# Altium schematic sheet Photo3.SchDoc
size A
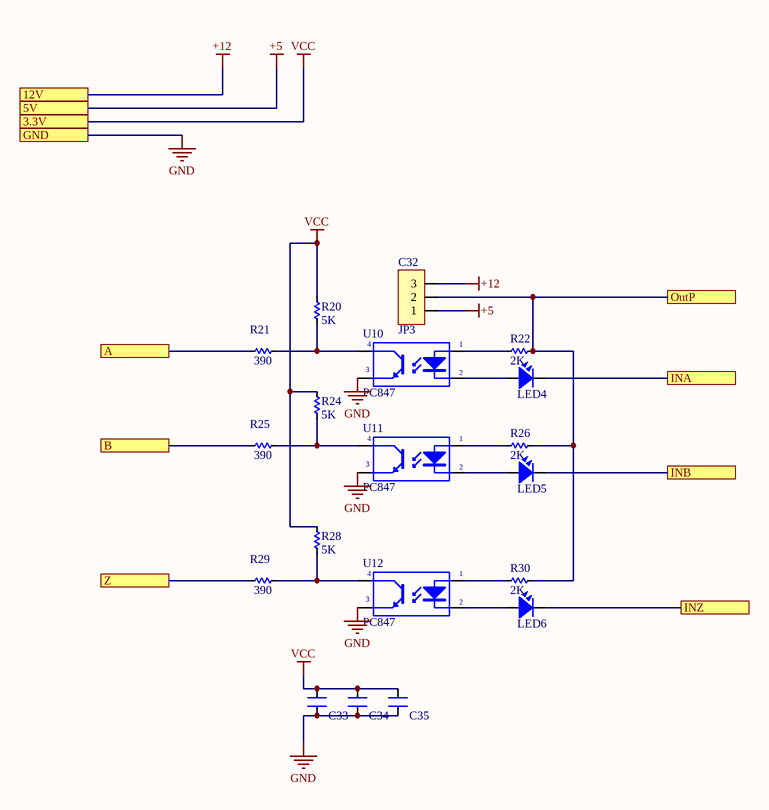
[diagram p0: Photo3.SchDoc]

## Parts
C32  JP3  [JP3-C1T]
C33  100nF  [CN-SMD-0603_big]  (value not drawn)
C34  CN  [CN-SMD-0603_big]  (value not drawn)
C35  CN  [CN-SMD-0603_big]  (value not drawn)
LED4  LED  [LED-0805-Green]  (value not drawn)
LED5  LED  [LED-0805-Green]  (value not drawn)
LED6  LED  [LED-0805-Green]  (value not drawn)
R20  5K  [RES-SMD-0603_BIG]
R21  390  [RES-SMD-0603_BIG]
R22  2K  [RES-SMD-0603_BIG]
R24  5K  [RES-SMD-0603_BIG]
R25  390  [RES-SMD-0603_BIG]
R26  2K  [RES-SMD-0603_BIG]
R28  5K  [RES-SMD-0603_BIG]
R29  390  [RES-SMD-0603_BIG]
R30  2K  [RES-SMD-0603_BIG]
U10  PC847  [DIP4]
U11  PC847  [DIP4]
U12  PC847  [DIP4]

## Ports
3.3V, 5V, 12V, A, B, GND, INA, INB, INZ, OutP, Z

## Nets
+5: C32.1 ; port 5V
+12: C32.3 ; port 12V
GND: C33.1 C34.1 C35.1 U10.3(E) U11.3(E) U12.3(E) ; port GND
VCC: C33.2 C34.2 C35.2 R20.1 R24.1 R28.1 ; port 3.3V
A: R21.1 ; port A
B: R25.1 ; port B
INA: LED4.2 ; port INA
INB: LED5.2 ; port INB
INZ: LED6.2 ; port INZ
OutP: C32.2 R22.1 R26.1 R30.1 ; port OutP
Z: R29.1 ; port Z
NetLED4_1: LED4.1 U10.2(K)
NetLED5_1: LED5.1 U11.2(K)
NetLED6_1: LED6.1 U12.2(K)
NetR20_2: R20.2 R21.2 U10.4(C)
NetR22_2: R22.2 U10.1(A)
NetR24_2: R24.2 R25.2 U11.4(C)
NetR26_2: R26.2 U11.1(A)
NetR28_2: R28.2 R29.2 U12.4(C)
NetR30_2: R30.2 U12.1(A)

## Library data of the parts
C32 = JP3: WR-PHD 2.54 mm Angled Socket Header; Manufacturer: W¨¹rth Elektronik eiSos GmbH; partNo: 613003143121; ComponentLink1 Description: Manufacturer; ComponentLink2 Description: Datasheet; NoPins: 03; Created Date: 29 March 2013; ComponentLink1URL: http://www.we-online.com; ComponentLink2URL: http://katalog.we-online.de/em/datasheet/6130xx143121.pdf; Created by: Karrer Zheng
C33-C35 = CN: Value: 33pF
LED4-LED6 = LED SMD: Value: LED 3 - 5 ly 2 Colour
R20-R22 R24-R26 R28-R30 = R
U10-U12 = PC817: Single Opto; Value: PC817